# Altium schematic sheet LCLFilter_Top.SchDoc
size A4; SheetNumber: 1; SheetTotal: 1
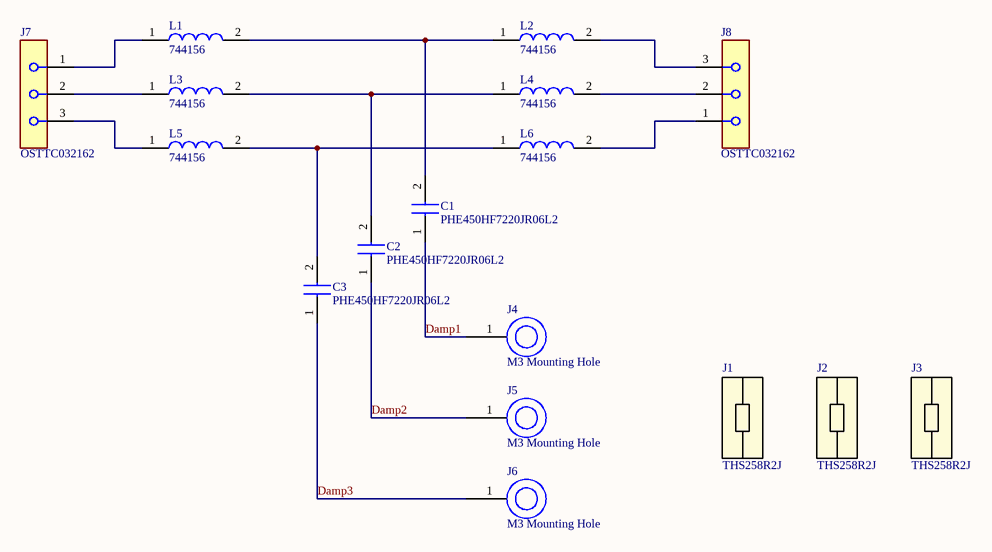
[diagram p0: LCLFilter_Top.SchDoc]

## Parts
C1  PHE450HF7220JR06L2  [Film Capacitor PHE450HF7220JR06L2]
C2  PHE450HF7220JR06L2  [Film Capacitor PHE450HF7220JR06L2]
C3  PHE450HF7220JR06L2  [Film Capacitor PHE450HF7220JR06L2]
J1  THS258R2J  [Resistor CONN2_ THS258R2J_TEC]
J2  THS258R2J  [Resistor CONN2_ THS258R2J_TEC]
J3  THS258R2J  [Resistor CONN2_ THS258R2J_TEC]
J4  M3 Mounting Hole  [M3 Mounting Hole]
J5  M3 Mounting Hole  [M3 Mounting Hole]
J6  M3 Mounting Hole  [M3 Mounting Hole]
J7  OSTTC032162  [3 Pin Terminal OSTTC032162_0]
J8  OSTTC032162  [3 Pin Terminal OSTTC032162_0]
L1  744156  [Toroid Inductor 744156]
L2  744156  [Toroid Inductor 744156]
L3  744156  [Toroid Inductor 744156]
L4  744156  [Toroid Inductor 744156]
L5  744156  [Toroid Inductor 744156]
L6  744156  [Toroid Inductor 744156]

## Nets
Damp1: C1.1 J4.1
Damp2: C2.1 J5.1
Damp3: C3.1 J6.1
NetC1_2: C1.2 L1.2 L2.1
NetC2_2: C2.2 L3.2 L4.1
NetC3_2: C3.2 L5.2 L6.1
NetJ7_1: J7.1 L1.1
NetJ7_2: J7.2 L3.1
NetJ7_3: J7.3 L5.1
NetJ8_1: J8.1 L6.2
NetJ8_2: J8.2 L4.2
NetJ8_3: J8.3 L2.2

## Library data of the parts
C1-C3 = PHE450HF7220JR06L2: Capacitor; Manufacturer_Name: KEMET; Datasheet Link: https://docs.rs-online.com/a458/0900766b817170df.pdf; Height: 24.5mm; Manufacturer_Part_Number: PHE450HF7220JR06L2
J1-J3 = THS258R2J: Resistor, Axial Leaded, 8.2 ohm, THS, 25 W, ± 5%, Solder Lug, 550 V; Mfr_Name: TE Connectivity; Copyright: Copyright (C) 2023 Ultra Librarian. All rights reserved.; Manufacturer_Part_Number: THS258R2J; Digi-Key_Part_Number_1: A105544-ND; RefDes: RefDes; Type: DEV
J7 J8 = OSTTC032162: 3 Position Terminal Block 5.08mm; Manufacturer: On Shore Technology; Voltage: 300V; Is Female: yes; helpURL: https://upverter.com/upn/revision/2b80058b23306b34/; ComponentLink2Description: Datasheet; Temperature: -30°C to +105°C; Package: HDR03; Supplier 2: Mouser; Price: 0.382016875697; Supplier 1: Digi-Key; ComponentLink1URL: https://upverter.com/upn/revision/2b80058b23306b34/; Supplier Part Number 1: ED2610-ND; ComponentLink1Description: Upverter; ComponentLink2URL: https://upverter.com/datasheet/d9a5d2e095ec14efdc364e45047c257fc4ca76eb.pdf; RoHS: TRUE; Temperature Range High: +105°C; Digikey Description: CONN TERM BLOCK 5.08MM VERT 3POS PCB; Digikey Part Number: ED2610-ND; Lead Free: yes; Temperature Range Low: -30°C; Part Number: OSTTC032162
L1-L6 = 744156: Toroidal Inductor, WE-SI, 380 µH, 6.2 A, 0.07 ohm, ± 20%; Manufacturer_Name: Wurth Elektronik; Manufacturer_Part_Number: 744156